# Altium schematic sheet Sheet1.SchDoc
size A4; SheetNumber: 1; SheetTotal: 1
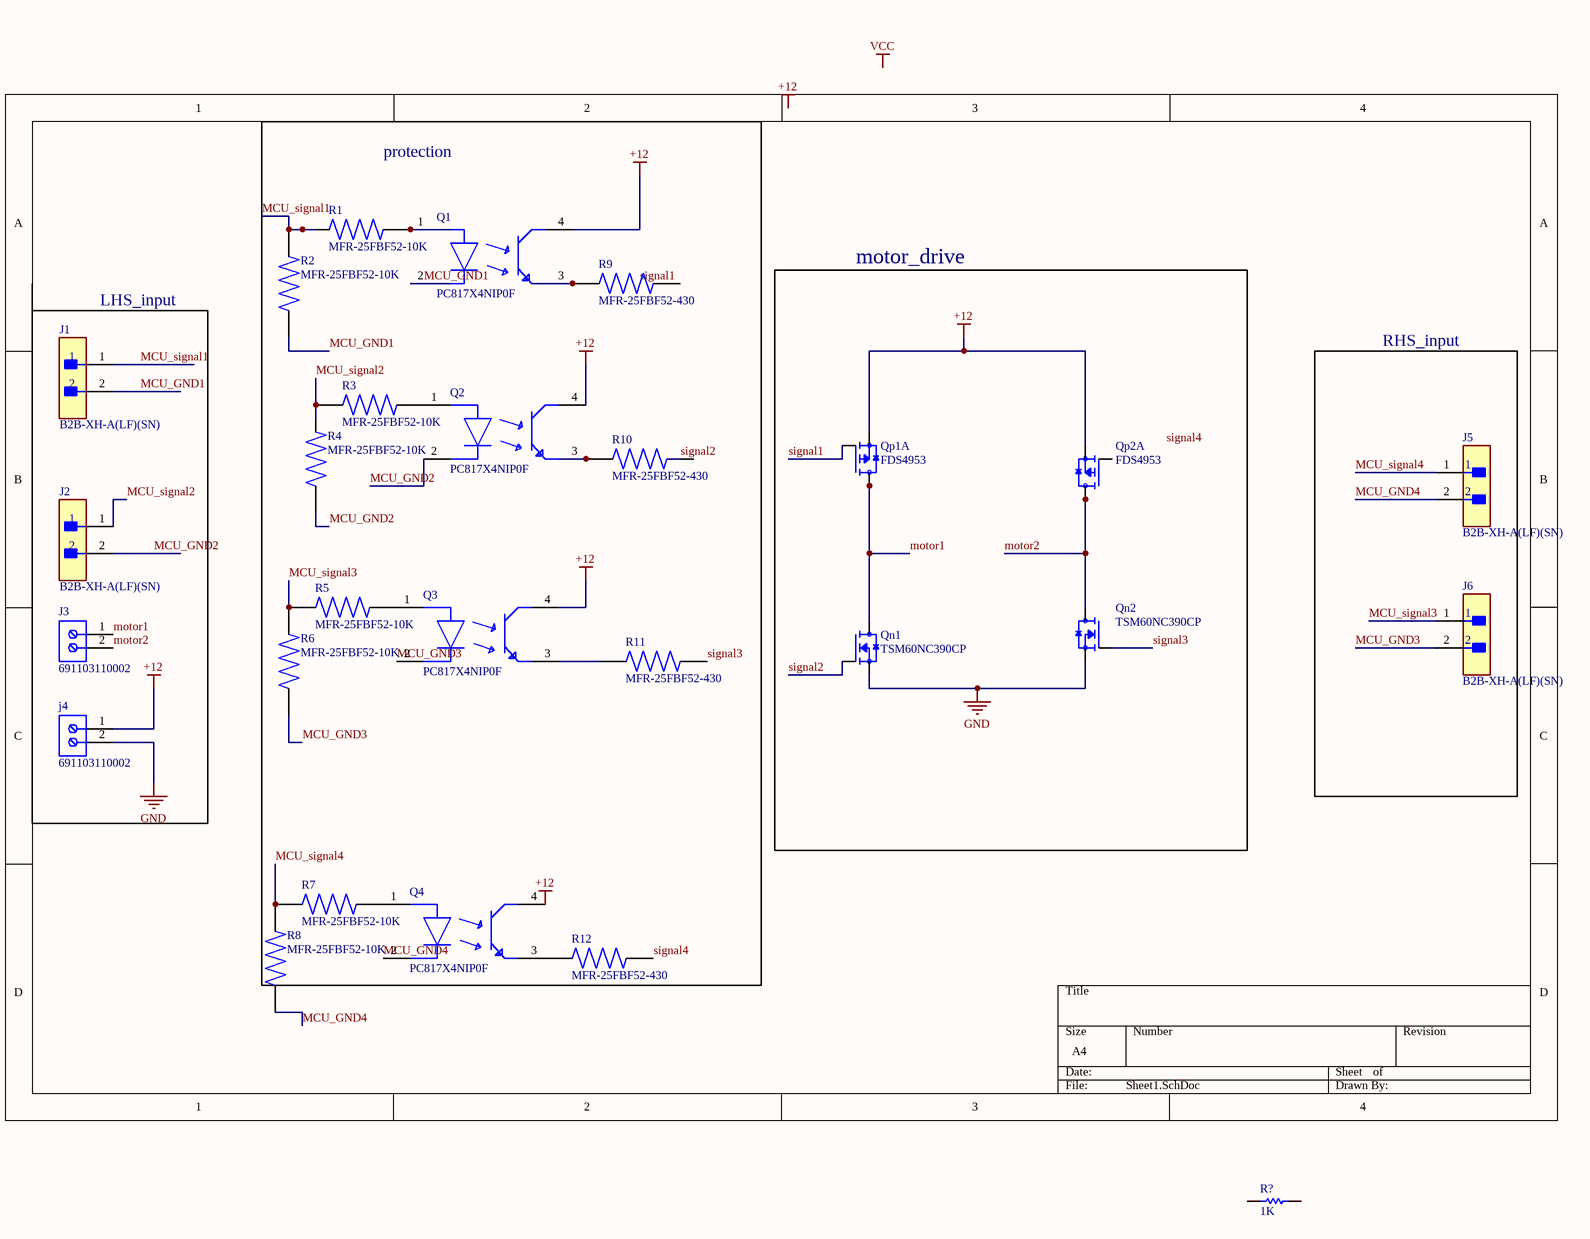
[diagram p0: Sheet1.SchDoc]

## Parts
J1  B2B-XH-A(LF)(SN)  [FP-B2B-XH-A_LF_SN-MFG]
J2  B2B-XH-A(LF)(SN)  [FP-B2B-XH-A_LF_SN-MFG]
J3  691103110002  [691103110002]
j4  691103110002  [691103110002]
J5  B2B-XH-A(LF)(SN)  [FP-B2B-XH-A_LF_SN-MFG]
J6  B2B-XH-A(LF)(SN)  [FP-B2B-XH-A_LF_SN-MFG]
Q1  PC817X4NIP0F  [FP-PC817X4NIP0F-MFG]
Q2  PC817X4NIP0F  [FP-PC817X4NIP0F-MFG]
Q3  PC817X4NIP0F  [FP-PC817X4NIP0F-MFG]
Q4  PC817X4NIP0F  [FP-PC817X4NIP0F-MFG]
Qn1  TSM60NC390CP  [TRANS_TSM60NC390CP]
Qn2  TSM60NC390CP  [TRANS_TSM60NC390CP]
Qp1  FDS4953  [SOIC127P600X175-8N]  (part A of 2)
Qp2  FDS4953  [SOIC127P600X175-8N]  (part A of 2)
R1  MFR-25FBF52-10K  [RESAD1100W55L680D260]
R2  MFR-25FBF52-10K  [RESAD1100W55L680D260]
R3  MFR-25FBF52-10K  [RESAD1100W55L680D260]
R4  MFR-25FBF52-10K  [RESAD1100W55L680D260]
R5  MFR-25FBF52-10K  [RESAD1100W55L680D260]
R6  MFR-25FBF52-10K  [RESAD1100W55L680D260]
R7  MFR-25FBF52-10K  [RESAD1100W55L680D260]
R8  MFR-25FBF52-10K  [RESAD1100W55L680D260]
R9  MFR-25FBF52-430  [RESAD1100W55L680D260]
R10  MFR-25FBF52-430  [RESAD1100W55L680D260]
R11  MFR-25FBF52-430  [RESAD1100W55L680D260]
R12  MFR-25FBF52-430  [RESAD1100W55L680D260]
R?  value 1K  (hidden comment: Resistor)

## Blocks framed on the sheet
protection: Q1-Q4 R1-R12
motor_drive: Qn1 Qn2 Qp1 Qp2
RHS_input: J5 J6

## Nets
+12: j4.1 Q1.4(C) Q2.4(C) Q3.4(C) Q4.4(C) Qp1.3(S) Qp2.3(S)
GND: j4.2 Qn1.3(S) Qn2.3(S)
MCU_GND1: J1.2 Q1.2(C) R2.1
MCU_GND2: J2.2 Q2.2(C) R4.1
MCU_GND3: J6.2 Q3.2(C) R6.1
MCU_GND4: J5.2 Q4.2(C) R8.1
MCU_signal1: J1.1 R1.1 R2.2
MCU_signal2: J2.1 R3.1 R4.2
MCU_signal3: J6.1 R5.1 R6.2
MCU_signal4: J5.1 R7.1 R8.2
motor1: J3.1 Qn1.2_4(D) Qp1.5(D) Qp1.6(D)
motor2: J3.2 Qn2.2_4(D) Qp2.5(D) Qp2.6(D)
signal1: Qp1.4(G)
signal2: Qn1.1(G)
signal3: Qn2.1(G) R11.2
signal4: R12.2
NetQ1_1: Q1.1(A) R1.2
NetQ1_3: Q1.3(E) R9.1
NetQ2_1: Q2.1(A) R3.2
NetQ2_3: Q2.3(E) R10.1
NetQ3_1: Q3.1(A) R5.2
NetQ3_3: Q3.3(E) R11.1
NetQ4_1: Q4.1(A) R7.2
NetQ4_3: Q4.3(E) R12.1

Not connected (* = marked no-connect by the designer): Qp2 4(G); R9 2; R10 2; R? 1 2

## Notes on the sheet
- LHS_input
- Labels drawn without touching a wire or pin: +12, signal1, signal4, VCC

## Library data of the parts
J1 J2 J5 J6 = CMP-2000-05888-3: CONN HEADER VERT 2POS 2.5MM; Current Rating: 3A; Voltage Rating: 250V; Number of Contacts: 2; Contact Resistance: 20mR; Wire/Cable Gauge: 22AWG; Insulation Resistance: 1GR; Connector Type: Male Pin; Packaging: Bulk; Contact Material: Brass; Lead Free: Lead Free; Orientation: Straight; Contact Plating: Tin; Max Current Rating: 3A; Termination: Solder; Fastening Type: Detent; Depth: 5.75mm; Housing Material: Polyamide; REACH SVHC: No SVHC; Series: XH; Voltage Rating (AC): 250V; Number of Positions: 2; Color: Natural; Contact Type: Male Pin; Max Voltage Rating (DC): 250V; Pitch: 2.5mm; Lead Pitch: 2.5mm; Mount: Through Hole; Max Operating Temperature: 85°C; Length: 7.4mm; Max Voltage Rating (AC): 250V; Min Operating Temperature: -25°C; Number of Rows: 1; Housing Color: White
J3 j4 = CMP-1502-03254-2: NexarPartId: 18818286; Pitch: 3.5052mm; Current Rating: 10A; Number of Positions Per Level: 2; Plating: Steel; Number of Levels: 1; Voltage: 125V; Wire/Cable Gauge: 26AWG; Stripping Length: -6mm; Wire Gauge (Min): 16AWG; Packaging: Box; Number of Rows: 1; Color: Blue; Height: 8.5mm; Current: 10A; Lead Pitch: 3.5mm; RoHS: Compliant; Housing Material: Nylon; Width: 8mm; Length: 7mm; Contact Plating: Tin; Number of Pins: 2; Mount: Through Hole; Min Operating Temperature: -40°C; Number of Contacts: 2; REACH SVHC: Unknown; Termination: Screw; Wire Gauge (Max): 26AWG; Max Operating Temperature: 105°C; Voltage Rating: 125V; Contact Material: Brass, Copper, Nickel, Tin, Zinc
Q1-Q4 = CMP-65434-000001-1: OPTOISOLATOR 5KV TRANS 4SMD; Manufacturer: Sharp; Collector Emitter Voltage: 80V; Standoff Height: 0.1mm; Power Dissipation: 200mW; Min Current Transfer Ratio: 50%; Reverse Voltage: 6V; Forward Current: 20mA; Forward Voltage: 1.2V; Max Current Transfer Ratio: 600%; Isolation Voltage: 5kVrms; Mouser Description: Transistor Output Optocouplers Photocoupler 300-600% CRT; RoHS: TRUE; ComponentLink2URL: https://www.sharpsde.com/fileadmin/products/Optoelectronics/Isolation%20Devices/Specs%20Photocoupler/PC817XxNIP0F_17Jun08_Spec_ED-04P129A.pdf; Lead Free: Yes; Device Class L1: Optoelectronics; ComponentLink2Description: Datasheet; Device Class L2: Optocouplers; Temperature: -30°C to +100°C; Temperature Range Low: -30°C; Automotive: No; Temperature Range High: +100°C; Octopart: https://octopart.com/pc817x4nip0f-sharp-20650453; Height: 4.6mm; Digikey Description: OPTOISOLATOR 5KV TRANS 4SMD; Category: Trans; Device Class L3: unset; Package: PC817X4NIP0F; Manufacturer Part Number: PC817X4NIP0F; Emiiter Collector Voltage: 6V
Qn1 Qn2 = TSM60NC390CP: 600V, 11A, Single N-Channel High Voltage MOSFETs; MF: Taiwan Semiconductor; SnapEDA_Link: https://www.snapeda.com/parts/TSM60NC390CP/Taiwan+Semiconductor/view-part/?ref=snap; Package: TO-252-3 Taiwan Semiconductor; Value: *; MP: TSM60NC390CP; Check_prices: https://www.snapeda.com/parts/TSM60NC390CP/Taiwan+Semiconductor/view-part/?ref=eda
Qp1 Qp2 = FDS4953: Mosfet Array 2 P-Channel _Dual_ 30V 5A 900mW Surface Mount 8-SOIC; MF: ON Semiconductor; Value: *; SnapEDA_Link: https://www.snapeda.com/parts/FDS4953/ON%20Semiconductor/view-part/1564044/?ref=snap; Package: SOIC-8 ON Semiconductor; MP: FDS4953; Price: None; Availability: Unavailable
R1-R12 = MFR-25FBF52-10K: 10.2 kOhms Â±1% 0.25W, 1/4W Through Hole Resistor Axial - Metal Film; MF: Yageo; SnapEDA_Link: https://www.snapeda.com/parts/MFR-25FBF52-10K/Yageo/view-part/?ref=snap; Availability: In Stock; Price: None; Value: *; Check_prices: https://www.snapeda.com/parts/MFR-25FBF52-10K/Yageo/view-part/?ref=eda; Purchase-URL: https://pricing.snapeda.com/search/part/MFR-25FBF52-10K/?ref=eda; MP: MFR-25FBF52-10K; Package: Axial Yageo
R? = Resistor: TC1: 0; SimulationGenericComponent: True; TC2: 0